# Altium schematic sheet SDCard.SchDoc: SD Card Connection
size A4; SheetNumber: 11; SheetTotal: 13
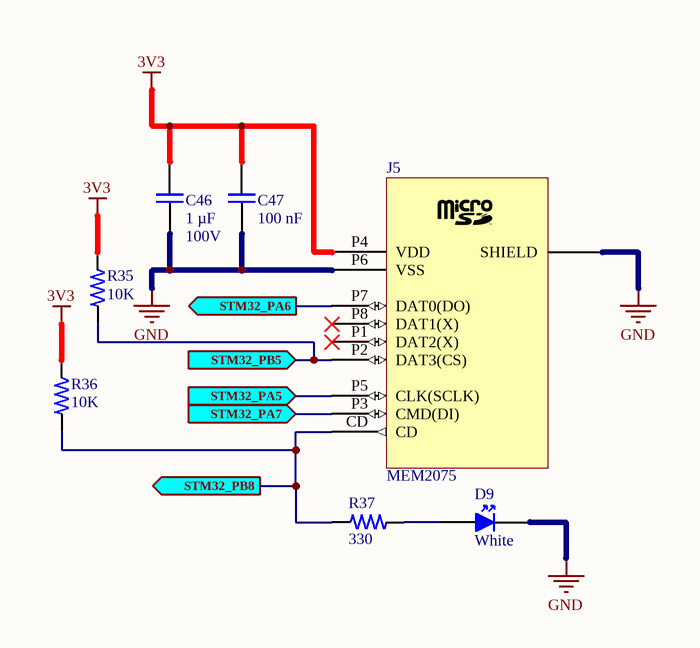
[diagram p0: SDCard.SchDoc]

## Parts
C46  1 µF  Voltage Rating: 100V  [MergenElektronik_Capacitors_Ceramics_SMDs_1206_M_NS]
C47  100 nF  [MergenElektronik_Capacitors_Ceramics_SMDs_0603_M_NS]
D9  White  [MergenElektronik_Leds_SMDs_0603_M_NS]
J5  MEM2075  [MergenElektronik_Connectors_MicroSD_MEM2075]
R35  10K  [MergenElektronik_Resistors_ChipResistors_0603_M_NS]
R36  10K  [MergenElektronik_Resistors_ChipResistors_0603_M_NS]
R37  330  [MergenElektronik_Resistors_ChipResistors_0603_M_NS]

## Ports
STM32_PA5 (in, see Microcontroller[2C]), STM32_PA6 (out, see Microcontroller[2C]), STM32_PA7 (in, see Microcontroller[2C]), STM32_PB5 (in, see Microcontroller[3C]), STM32_PB8 (out, see Microcontroller[3C])

## Nets
3V3: C46.1 C47.1 J5.P4(VDD) R35.1 R36.1
GND: C46.2 C47.2 D9.2(KATOT) J5.P6(VSS) J5.SHIELD
STM32_PA5: J5.P5(CLK(SCLK)) ; port STM32_PA5
STM32_PA6: J5.P7(DAT0(DO)) ; port STM32_PA6
STM32_PA7: J5.P3(CMD(DI)) ; port STM32_PA7
STM32_PB5: J5.P2(DAT3(CS)) R35.2 ; port STM32_PB5
STM32_PB8: J5.CD R36.2 R37.1 ; port STM32_PB8
NetD9_1: D9.1(ANOT) R37.2

Not connected (* = marked no-connect by the designer): J5 P1(DAT2(X))* P8(DAT1(X))*

## Notes on the sheet
- Title:
- Size:
- Date:
- A4
- Number:
- Time:
- Revision:
- Sheet
- of
- Project
- Drawn By :

## Library data of the parts
C46 = MergenElektronik_Capacitors_Ceramic_SMDs_1µF_100V: Mergen Elektronik - Capacitors - Ceramics - SMDs - 1206 - 1 µF - 100V; Manufacturer: Samsung Electro-Mechanics; Manufacturer Number: CL31B105KCHNNNE; Model: Ceramic Capacitors; Tolerance: ±10%; Value: 1 µF; Temperature: -55°C up to +125°C; Digi-Key Number: 1276-1838-1-ND; Package: 1206(3216 Metric); Mouser Number: 187-CL31B105KCHNNNE; Mounting Type: Surface Mount; Özdisan Number: CL31B105KCHNNNE; Supplier 1: Digikey; Supplier 2: Mouser; Supplier Part Number 1: 1276-1838-1-ND; Supplier Part Number 2: 187-CL31B105KCHNNNE
C47 = MergenElektronik_Capacitors_Ceramic_SMDs_100nF_100V: Mergen Elektronik - Capacitors - Ceramics - SMDs - 0603 - 100 nF - 100V; Manufacturer: Samsung Electro-Mechanics; Manufacturer Number: CL10B104KC8NNNC; Model: Ceramic Capacitors; Tolerance: ±10%; Value: 100 nF; Temperature: -55°C up to +125°C; Digi-Key Number: 1276-6807-1-ND; Package: 0603(1608 Metric); Mouser Number: 187-CL10B104KC8NNNC; Mounting Type: Surface Mount; Farnell Number: 3013412; Özdisan Number: CL10B104KC8NNNC; Supplier 1: Digikey; Supplier 2: Mouser; Supplier Part Number 1: 1276-6807-1-ND; Supplier Part Number 2: 187-CL10B104KC8NNNC; Voltage Rating: 100V
D9 = MergenElektronik_LEDs_SMDs_White_0603: Mergen Elektronik - Leds - SMDs - White - 0603; Manufacturer: Harvatek Corporation; Manufacturer Number: B1931TW--20P000314U1930; Voltage Rating: 3.2V; Model: SMD Leds; Value: White; Temperature: -40°C up to +85°C; Digi-Key Number: 3147-B1931TW--20P000314U1930CT-ND; Package: 0603(1608); Mounting Type: Surface Mount; Color: White; Supplier 1: Digi-Key; Supplier Part Number 1: 3147-B1931TW--20P000314U1930TR-ND
J5 = MergenElektronik_Connectors_MicroSD_MEM2075: Mergen Elektronik - Connectors - SD Card Connectors - MEM2075; Manufacturer: GCT; Manufacturer Number: MEM2075-00-140-01-A; Voltage Rating: 30VDC/AC; Current Rating: 500 mA per pin.; Farnell Number: 2895610; Value: MEM2075; Model: Micro SD; Temperature: -25°C up to +85°C; Package: MEM2075; Mounting Type: Surface Mount; Mouser Number: 640-MEM20750014001A; Digi-Key Number: 2073-MEM2075-00-140-01-ACT-ND; Supplier 1: Digi-Key; Supplier Part Number 1: 2073-MEM2075-00-140-01-ADKR-ND; Supplier 2: Mouser; Supplier Part Number 2: 640-MEM20750014001A
R35 R36 = MergenElektronik_Resistors_ChipResistors_0603_10K: Mergen Elektronik - Resistors - Chip Resistors - 0603 - 10K; Manufacturer: Stackpole Electronics Inc; Manufacturer Number: RMCF0603JT10K0; Value: Chip Resistor - 0603 - 10K; Power: 1/10W; Tolerance: ±5%; Package: 0603(1608); Temperature: -55°C up to +155°C - X8R; Model: Chip Resistor; Digi-Key Number: RMCF0603JT10K0CT-ND; Mounting Type: Surface Mount; Supplier 1: Digi-Key; Supplier Part Number 1: RMCF0603JT10K0-ND
R37 = MergenElektronik_Resistors_ChipResistors_0603_330R: Mergen Elektronik - Resistors - Chip Resistors - 0603 - 330R; Manufacturer: Stackpole Electronics Inc; Manufacturer Number: RMCF0603JT330R; Value: Chip Resistor - 0603 - 330R; Power: 1/10W; Tolerance: ±5%; Package: 0603(1608); Temperature: -55°C up to +155°C - X8R; Model: Chip Resistor; Digi-Key Number: RMCF0603JT330RCT-ND; Mounting Type: Surface Mount; Supplier 1: Digi-Key; Supplier Part Number 1: RMCF0603JT330RCT-ND